# Altium schematic sheet Thermistor_ADC.SchDoc
size OrCAD B; SheetNumber: 7; SheetTotal: 11
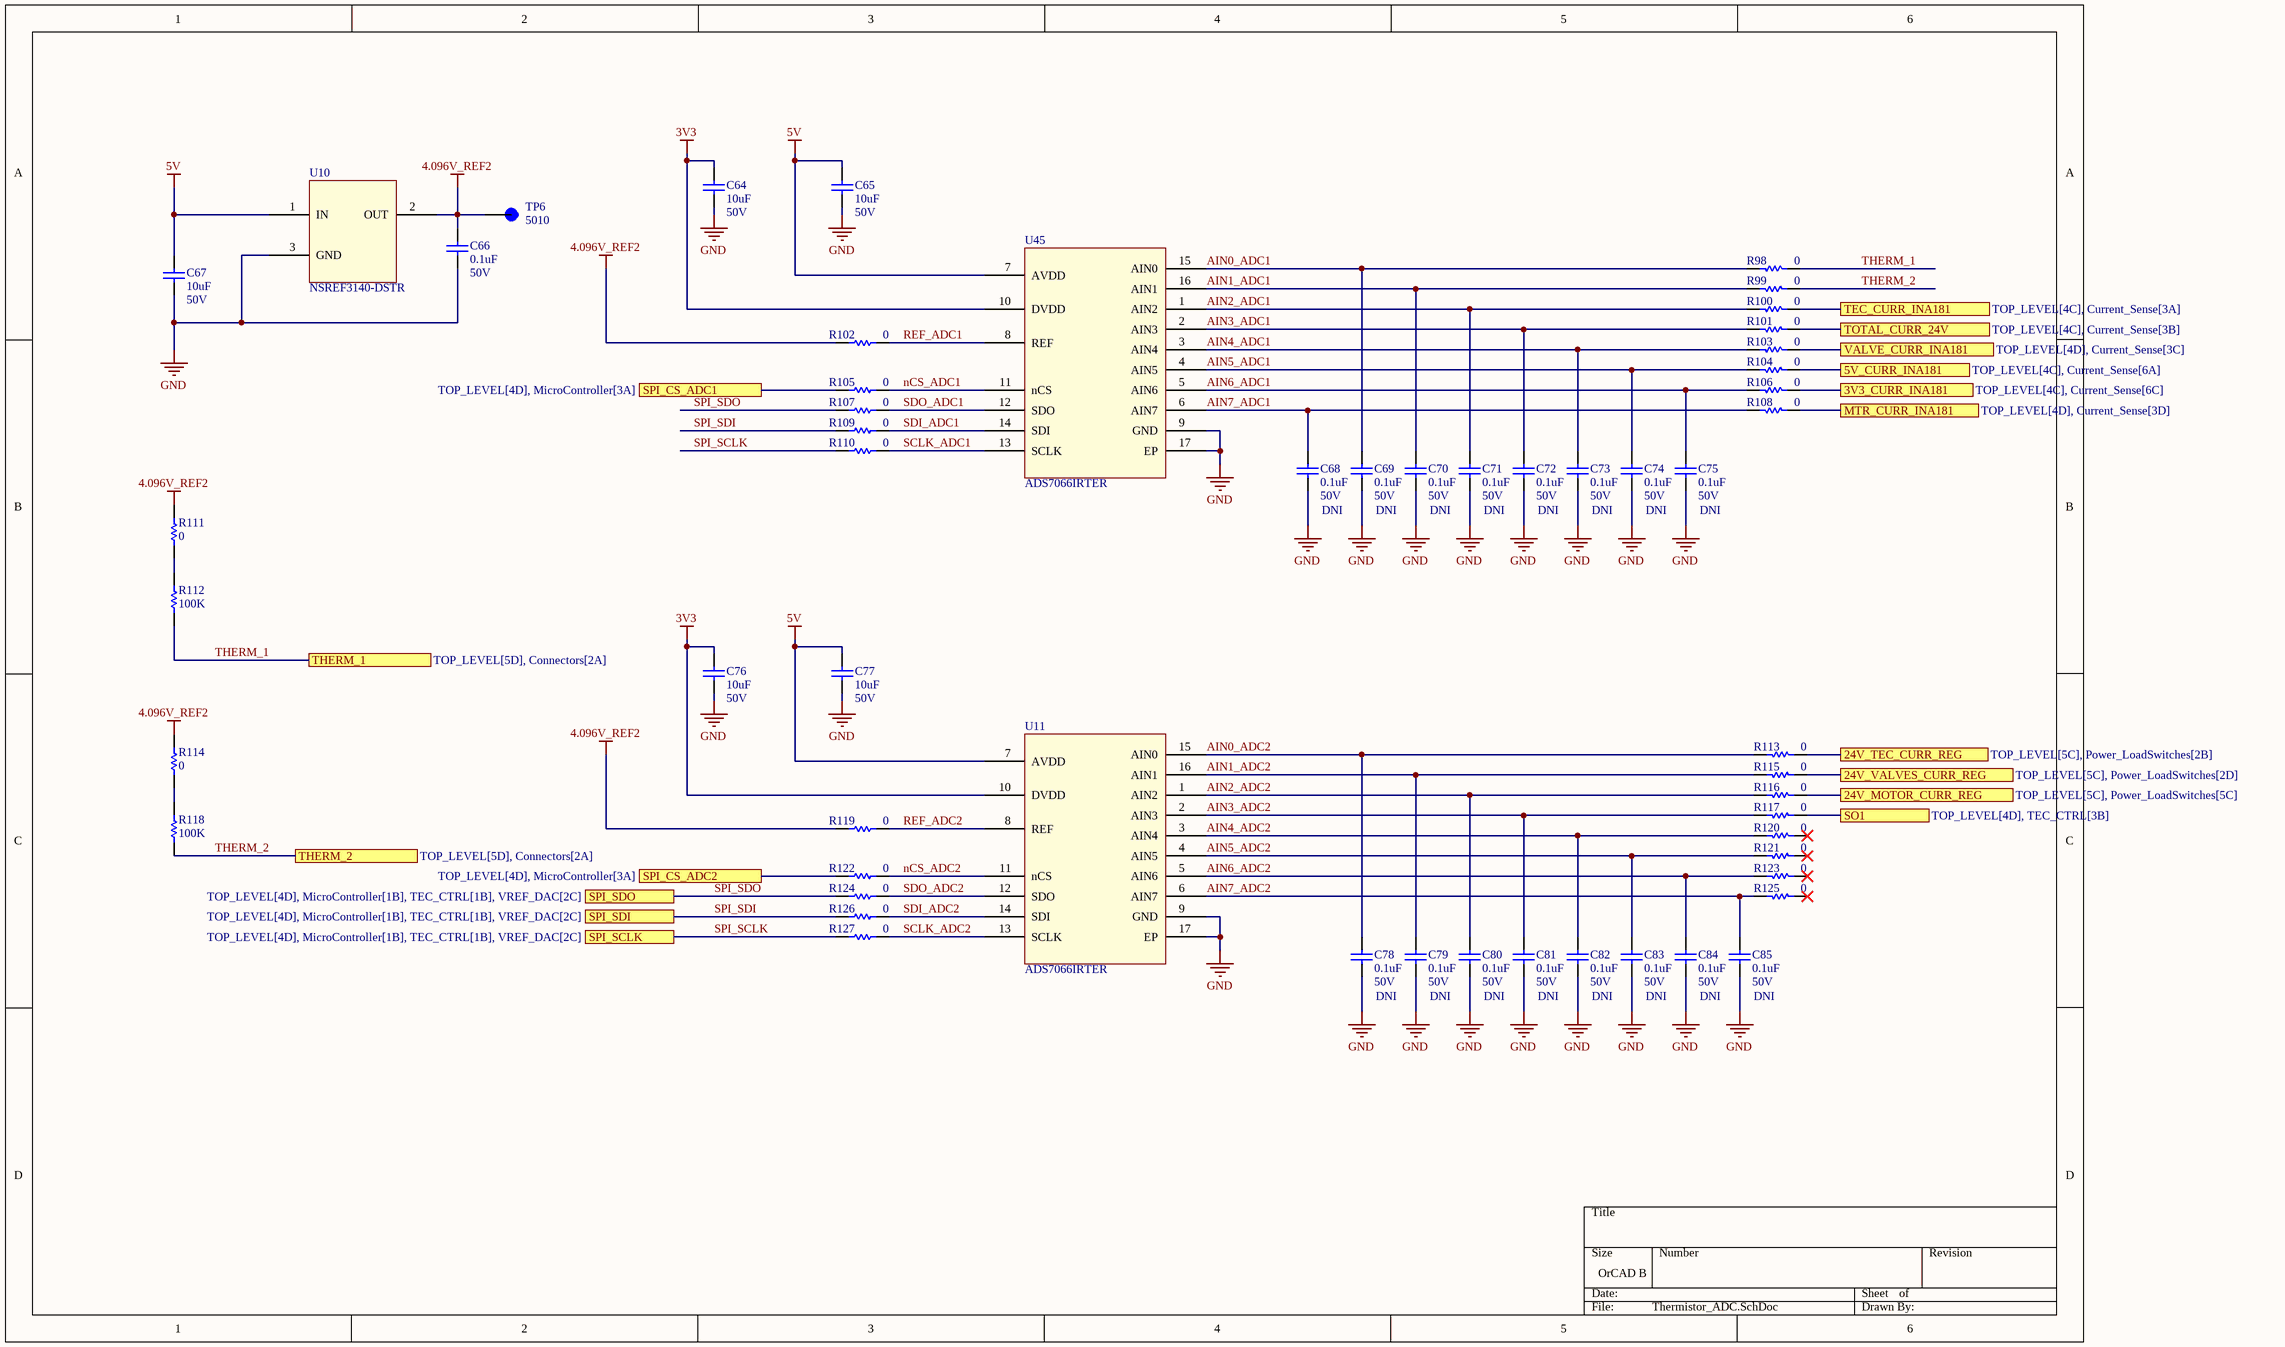
[diagram p0: Thermistor_ADC.SchDoc]

## Parts
C64  value 10uF  Rating: 50V  [DEFAULT_CAPACITOR_0805]  (hidden comment: GRM21BR61H106KE43L)
C65  value 10uF  Rating: 50V  [DEFAULT_CAPACITOR_0805]  (hidden comment: GRM21BR61H106KE43L)
C66  value 0.1uF  Rating: 50V  [DEFAULT_CAPACITOR_0805]  (hidden comment: KGM21NR71H104KT)
C67  value 10uF  Rating: 50V  [DEFAULT_CAPACITOR_0805]  (hidden comment: GRM21BR61H106KE43L)
C68  DNI  value 0.1uF  Rating: 50V  [DEFAULT_CAPACITOR_0805]
C69  DNI  value 0.1uF  Rating: 50V  [DEFAULT_CAPACITOR_0805]
C70  DNI  value 0.1uF  Rating: 50V  [DEFAULT_CAPACITOR_0805]
C71  DNI  value 0.1uF  Rating: 50V  [DEFAULT_CAPACITOR_0805]
C72  DNI  value 0.1uF  Rating: 50V  [DEFAULT_CAPACITOR_0805]
C73  DNI  value 0.1uF  Rating: 50V  [DEFAULT_CAPACITOR_0805]
C74  DNI  value 0.1uF  Rating: 50V  [DEFAULT_CAPACITOR_0805]
C75  DNI  value 0.1uF  Rating: 50V  [DEFAULT_CAPACITOR_0805]
C76  value 10uF  Rating: 50V  [DEFAULT_CAPACITOR_0805]  (hidden comment: GRM21BR61H106KE43L)
C77  value 10uF  Rating: 50V  [DEFAULT_CAPACITOR_0805]  (hidden comment: GRM21BR61H106KE43L)
C78  DNI  value 0.1uF  Rating: 50V  [DEFAULT_CAPACITOR_0805]
C79  DNI  value 0.1uF  Rating: 50V  [DEFAULT_CAPACITOR_0805]
C80  DNI  value 0.1uF  Rating: 50V  [DEFAULT_CAPACITOR_0805]
C81  DNI  value 0.1uF  Rating: 50V  [DEFAULT_CAPACITOR_0805]
C82  DNI  value 0.1uF  Rating: 50V  [DEFAULT_CAPACITOR_0805]
C83  DNI  value 0.1uF  Rating: 50V  [DEFAULT_CAPACITOR_0805]
C84  DNI  value 0.1uF  Rating: 50V  [DEFAULT_CAPACITOR_0805]
C85  DNI  value 0.1uF  Rating: 50V  [DEFAULT_CAPACITOR_0805]
R98  value 0  [DEFAULT_RESISTOR_0805]  (hidden comment: RC0805JR-070RL)
R99  value 0  [DEFAULT_RESISTOR_0805]  (hidden comment: RC0805JR-070RL)
R100  value 0  [DEFAULT_RESISTOR_0805]  (hidden comment: RC0805JR-070RL)
R101  value 0  [DEFAULT_RESISTOR_0805]  (hidden comment: RC0805JR-070RL)
R102  value 0  [DEFAULT_RESISTOR_0805]  (hidden comment: RC0805JR-070RL)
R103  value 0  [DEFAULT_RESISTOR_0805]  (hidden comment: RC0805JR-070RL)
R104  value 0  [DEFAULT_RESISTOR_0805]  (hidden comment: RC0805JR-070RL)
R105  value 0  [DEFAULT_RESISTOR_0805]  (hidden comment: RC0805JR-070RL)
R106  value 0  [DEFAULT_RESISTOR_0805]  (hidden comment: RC0805JR-070RL)
R107  value 0  [DEFAULT_RESISTOR_0805]  (hidden comment: RC0805JR-070RL)
R108  value 0  [DEFAULT_RESISTOR_0805]  (hidden comment: RC0805JR-070RL)
R109  value 0  [DEFAULT_RESISTOR_0805]  (hidden comment: RC0805JR-070RL)
R110  value 0  [DEFAULT_RESISTOR_0805]  (hidden comment: RC0805JR-070RL)
R111  value 0  [DEFAULT_RESISTOR_0805]  (hidden comment: RC0805JR-070RL)
R112  value 100K  [DEFAULT_RESISTOR_0805]  (hidden comment: RG2012P-104-B-T5)
R113  value 0  [DEFAULT_RESISTOR_0805]  (hidden comment: RC0805JR-070RL)
R114  value 0  [DEFAULT_RESISTOR_0805]  (hidden comment: RC0805JR-070RL)
R115  value 0  [DEFAULT_RESISTOR_0805]  (hidden comment: RC0805JR-070RL)
R116  value 0  [DEFAULT_RESISTOR_0805]  (hidden comment: RC0805JR-070RL)
R117  value 0  [DEFAULT_RESISTOR_0805]  (hidden comment: RC0805JR-070RL)
R118  value 100K  [DEFAULT_RESISTOR_0805]  (hidden comment: RG2012P-104-B-T5)
R119  value 0  [DEFAULT_RESISTOR_0805]  (hidden comment: RC0805JR-070RL)
R120  value 0  [DEFAULT_RESISTOR_0805]  (hidden comment: RC0805JR-070RL)
R121  value 0  [DEFAULT_RESISTOR_0805]  (hidden comment: RC0805JR-070RL)
R122  value 0  [DEFAULT_RESISTOR_0805]  (hidden comment: RC0805JR-070RL)
R123  value 0  [DEFAULT_RESISTOR_0805]  (hidden comment: RC0805JR-070RL)
R124  value 0  [DEFAULT_RESISTOR_0805]  (hidden comment: RC0805JR-070RL)
R125  value 0  [DEFAULT_RESISTOR_0805]  (hidden comment: RC0805JR-070RL)
R126  value 0  [DEFAULT_RESISTOR_0805]  (hidden comment: RC0805JR-070RL)
R127  value 0  [DEFAULT_RESISTOR_0805]  (hidden comment: RC0805JR-070RL)
TP6  5010  [TP_5011]
U10  NSREF3140-DSTR  [NSREF3140DSTR-SOT23-3L]
U11  ADS7066IRTER  [ADS7066IRTER-WQFN16]
U45  ADS7066IRTER  [ADS7066IRTER-WQFN16]

## Ports
3V3_CURR_INA181 (see TOP_LEVEL[4C], Current_Sense[6C]), 5V_CURR_INA181 (see TOP_LEVEL[4C], Current_Sense[6A]), 24V_MOTOR_CURR_REG (see TOP_LEVEL[5C], Power_LoadSwitches[5C]), 24V_TEC_CURR_REG (see TOP_LEVEL[5C], Power_LoadSwitches[2B]), 24V_VALVES_CURR_REG (see TOP_LEVEL[5C], Power_LoadSwitches[2D]), MTR_CURR_INA181 (see TOP_LEVEL[4D], Current_Sense[3D]), SO1 (see TOP_LEVEL[4D], TEC_CTRL[3B]), SPI_CS_ADC1 (see TOP_LEVEL[4D], MicroController[3A]), SPI_CS_ADC2 (see TOP_LEVEL[4D], MicroController[3A]), SPI_SCLK (see TOP_LEVEL[4D], MicroController[1B], TEC_CTRL[1B], VREF_DAC[2C]), SPI_SDI (see TOP_LEVEL[4D], MicroController[1B], TEC_CTRL[1B], VREF_DAC[2C]), SPI_SDO (see TOP_LEVEL[4D], MicroController[1B], TEC_CTRL[1B], VREF_DAC[2C]), TEC_CURR_INA181 (see TOP_LEVEL[4C], Current_Sense[3A]), THERM_1 (see TOP_LEVEL[5D], Connectors[2A]), THERM_2 (see TOP_LEVEL[5D], Connectors[2A]), TOTAL_CURR_24V (see TOP_LEVEL[4C], Current_Sense[3B]), VALVE_CURR_INA181 (see TOP_LEVEL[4D], Current_Sense[3C])

## Nets
3V3: C64.2 C76.2 U11.10(DVDD) U45.10(DVDD)
4.096V_REF2: C66.2 R102.2 R111.1 R114.1 R119.2 TP6.TP U10.2(OUT)
5V: C65.2 C67.2 C77.2 U10.1(IN) U11.7(AVDD) U45.7(AVDD)
GND: C64.1 C65.1 C66.1 C67.1 C68.1 C69.1 C70.1 C71.1 C72.1 C73.1 C74.1 C75.1 C76.1 C77.1 C78.1 C79.1 C80.1 C81.1 C82.1 C83.1 C84.1 C85.1 U10.3(GND) U11.9(GND) U11.17(EP) U45.9(GND) U45.17(EP)
3V3_CURR_INA181: R106.2 ; port 3V3_CURR_INA181
5V_CURR_INA181: R104.2 ; port 5V_CURR_INA181
24V_MOTOR_CURR_REG: R116.2 ; port 24V_MOTOR_CURR_REG
24V_TEC_CURR_REG: R113.2 ; port 24V_TEC_CURR_REG
24V_VALVES_CURR_REG: R115.2 ; port 24V_VALVES_CURR_REG
AIN0_ADC1: C69.2 R98.1 U45.15(AIN0)
AIN0_ADC2: C78.2 R113.1 U11.15(AIN0)
AIN1_ADC1: C70.2 R99.1 U45.16(AIN1)
AIN1_ADC2: C79.2 R115.1 U11.16(AIN1)
AIN2_ADC1: C71.2 R100.1 U45.1(AIN2)
AIN2_ADC2: C80.2 R116.1 U11.1(AIN2)
AIN3_ADC1: C72.2 R101.1 U45.2(AIN3)
AIN3_ADC2: C81.2 R117.1 U11.2(AIN3)
AIN4_ADC1: C73.2 R103.1 U45.3(AIN4)
AIN4_ADC2: C82.2 R120.1 U11.3(AIN4)
AIN5_ADC1: C74.2 R104.1 U45.4(AIN5)
AIN5_ADC2: C83.2 R121.1 U11.4(AIN5)
AIN6_ADC1: C75.2 R106.1 U45.5(AIN6)
AIN6_ADC2: C84.2 R123.1 U11.5(AIN6)
AIN7_ADC1: C68.2 R108.1 U45.6(AIN7)
AIN7_ADC2: C85.2 R125.1 U11.6(AIN7)
MTR_CURR_INA181: R108.2 ; port MTR_CURR_INA181
nCS_ADC1: R105.1 U45.11(nCS)
nCS_ADC2: R122.1 U11.11(nCS)
REF_ADC1: R102.1 U45.8(REF)
REF_ADC2: R119.1 U11.8(REF)
SCLK_ADC1: R110.1 U45.13(SCLK)
SCLK_ADC2: R127.1 U11.13(SCLK)
SDI_ADC1: R109.1 U45.14(SDI)
SDI_ADC2: R126.1 U11.14(SDI)
SDO_ADC1: R107.1 U45.12(SDO)
SDO_ADC2: R124.1 U11.12(SDO)
SO1: R117.2 ; port SO1
SPI_CS_ADC1: R105.2 ; port SPI_CS_ADC1
SPI_CS_ADC2: R122.2 ; port SPI_CS_ADC2
SPI_SCLK: R110.2 R127.2 ; port SPI_SCLK
SPI_SDI: R109.2 R126.2 ; port SPI_SDI
SPI_SDO: R107.2 R124.2 ; port SPI_SDO
TEC_CURR_INA181: R100.2 ; port TEC_CURR_INA181
THERM_1: R98.2 R112.2 ; port THERM_1
THERM_2: R99.2 R118.2 ; port THERM_2
TOTAL_CURR_24V: R101.2 ; port TOTAL_CURR_24V
VALVE_CURR_INA181: R103.2 ; port VALVE_CURR_INA181
NetR111_2: R111.2 R112.1
NetR114_2: R114.2 R118.1

Not connected (* = marked no-connect by the designer): R120 2*; R121 2*; R123 2*; R125 2*

## Library data of the parts
C64 C65 C67 C76 C77 = GRM21BR61H106KE43L: CAP CER 10UF 50V X5R 0805; MFR PN: GRM21BR61H106KE43L
C66 C68-C75 C78-C85 = KGM21NR71H104KT: CAP CER 0.1UF 50V X7R 0805; Manufacturer: Cal-Chip Electronics, Inc.; Manufacturer P/N: GMC55X7R226M50NT; MFR PN: KGM21NR71H104KT
R98-R111 R113-R117 R119-R127 = RC0805JR-070RL: RES 0 OHM JUMPER 1/8W 0805; Power: 1/8W; MFR PN: RC0805JR-070RL; Tolerance: *
R112 R118 = RG2012P-104-B-T5: RES SMD 100K OHM 0.1% 1/8W 0805; Power: 1/8W; MFR PN: RG2012P-104-B-T5; Tolerance: 0.1%
TP6 = 5010: PC TEST POINT MULTIPURPOSE RED; MFR PN: 5010
U10 = NSREF3140-DSTR: 0.2% ACCURACY 15PPM 4V REF; Manufacturer: NOVOSENSE; Manufacturer P/N: NSREF3140-DSTR; MFR PN: NSREF3140-DSTR
U11 U45 = ADS7066IRTER: 16 Bit Analog to Digital Converter 8 Input 1 SAR 16-WQFN (3x3); Manufacturer: Texas Instruments; Manufacturer P/N: ADS7066IRTER; MFR PN: ADS7066IRTER